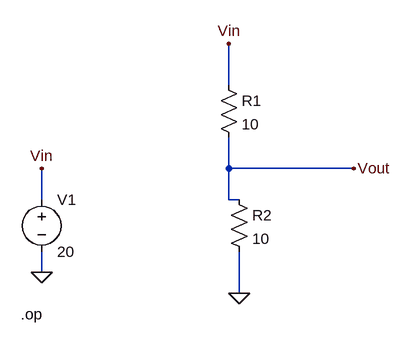
[diagram p0: schematic Draft10.asc]
Draft10.asc, the LTspice schematic file:
Version 4
SHEET 1 880 680
WIRE 176 -448 176 -512
WIRE 176 -320 176 -368
WIRE 368 -320 176 -320
WIRE -112 -272 -112 -320
WIRE 176 -272 176 -320
WIRE 192 -272 176 -272
WIRE -112 -160 -112 -192
WIRE 192 -128 192 -192
FLAG -112 -160 0
FLAG -112 -320 Vin
FLAG 192 -128 0
FLAG 176 -512 Vin
FLAG 368 -320 Vout
SYMBOL voltage -112 -288 R0
WINDOW 123 0 0 Left 0
WINDOW 39 0 0 Left 0
SYMATTR InstName V1
SYMATTR Value 20
SYMBOL res 160 -464 R0
SYMATTR InstName R1
SYMATTR Value 10
SYMBOL res 176 -288 R0
SYMATTR InstName R2
SYMATTR Value 10
TEXT -144 -96 Left 2 !.op

The netlist it stands for:
* Draft10.asc
V1 Vin 0 20
R1 Vin Vout 10
R2 Vout 0 10
.op
.backanno
.end

* Results of the author's LTspice run, read from the files saved beside the schematic
* Operating Point:
*   V(vin) = 20 V
*   V(vout) = 10 V
*   I(R1) = 1 A
*   I(R2) = 1 A
*   I(V1) = -1 A